# EAGLE design WT32-SC01 (EAGLE 9.6.2)
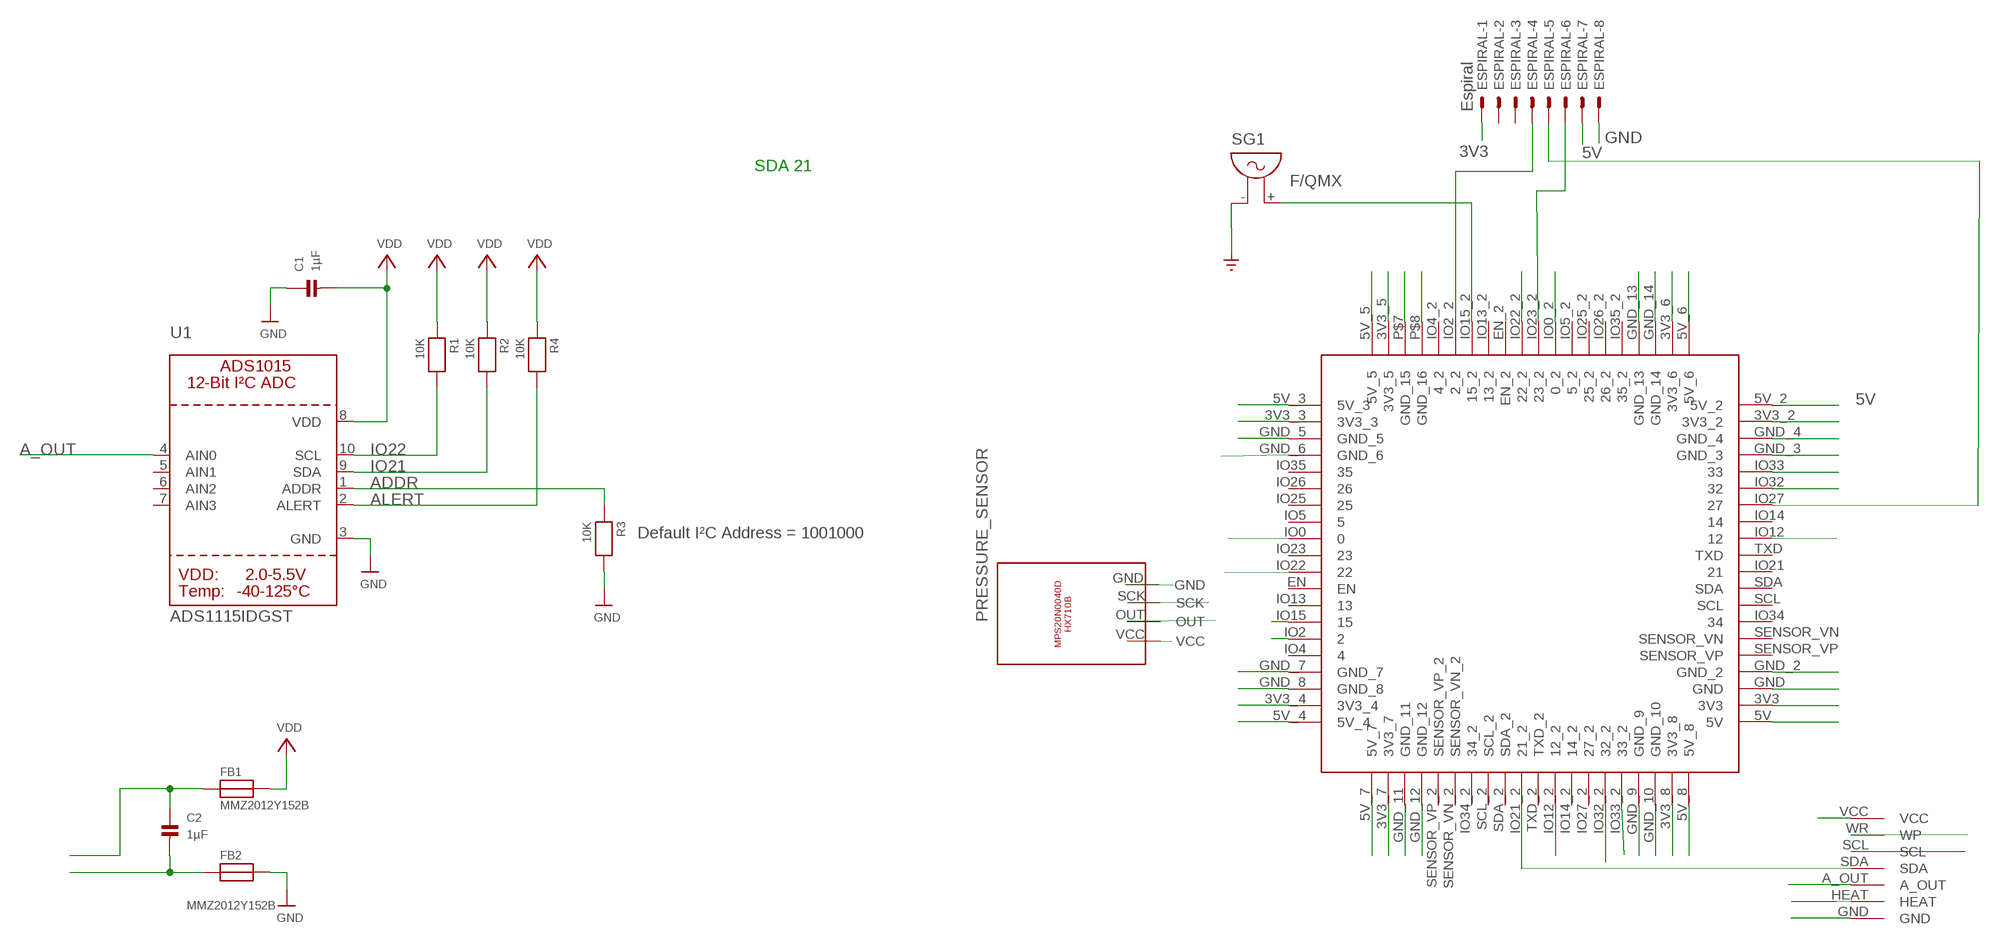
[diagram p0: schematic, sheet 1]

## Parts
C1  1µF  CAP_CERAMIC0805  [0805]
C2  1µF  CAP_CERAMIC0805  [0805]
ESPIRAL  Espiral  22-05-7088-08  [7395-08]
FB1  MMZ2012Y152B  FERRITE0805  [0805]
FB2  MMZ2012Y152B  FERRITE0805  [0805]
PRESSURE_SENSOR  PRESSURE_SENSORWITH_SMDPADS&THROUGHHOLES  [MPS20N0040D]
R1  10K  RESISTOR0805  [0805]
R2  10K  RESISTOR0805  [0805]
R3  10K  RESISTOR0805  [0805]
R4  10K  RESISTOR0805  [0805]
SG1  F/QMX  [F/QMX]
U1  ADS1115IDGST  ADC_ADS1015  [MSOP10]
U$1  SENSOR  [SENSOR]
U$2  WT32_SC01  [WT32]

## Nets
3V3: ESPIRAL.1 U$2.3V3 U$2.3V3_2 U$2.3V3_3 U$2.3V3_4 U$2.3V3_5 U$2.3V3_6
5V: ESPIRAL.7 FB1.2 PRESSURE_SENSOR.VCC U$1.VCC U$2.5V U$2.5V_2 U$2.5V_3 U$2.5V_4 U$2.5V_5 U$2.5V_6 U$2.5V_7 U$2.5V_8 ; supply symbol labelled VDD
A_OUT: U1.4(AIN0) U$1.A_OUT
ADDR: R3.1 U1.1(ADDR)
ALERT: R4.2 U1.2(ALERT)
GND: C1.1 ESPIRAL.8 FB2.2 PRESSURE_SENSOR.GND R3.2 SG1.- U1.3(GND) U$1.GND U$2.GND U$2.GND_2 U$2.GND_3 U$2.GND_4 U$2.GND_5 U$2.GND_6 U$2.GND_7 U$2.GND_8 U$2.GND_9 U$2.GND_10 U$2.GND_11 U$2.GND_12 U$2.GND_13 U$2.GND_14 U$2.P$7(GND_15) U$2.P$8(GND_16) ; supply symbol labelled SUPPLY_BRASTAN_GND_
IO0: U$1.HEAT U$2.IO0 U$2.IO0_2(0_2)
IO2: ESPIRAL.4 U$2.IO2 U$2.IO2_2(2_2)
IO12: U$1.WR(WP) U$2.IO12 U$2.IO12_2(12_2)
IO15: SG1.+ U$2.IO15 U$2.IO15_2(15_2)
IO21: R2.2 U1.9(SDA) U$1.SDA U$2.IO21_2(21_2)
IO22: R1.2 U1.10(SCL) U$1.SCL U$2.IO22 U$2.IO22_2(22_2)
IO32: PRESSURE_SENSOR.OUT U$2.IO32 U$2.IO32_2(32_2)
IO33: PRESSURE_SENSOR.SCK U$2.IO33 U$2.IO33_2(33_2)
N$1: ESPIRAL.6 U$2.IO23_2(23_2)
N$2: C2.2 FB2.1
N$3: C2.1 FB1.1
N$5: U$2.3V3_8
N$6: U$2.3V3_7
N$23: ESPIRAL.5 U$2.IO27
VDD: C1.2 R1.1 R2.1 R4.1 U1.8(VDD)
Unconnected: ESPIRAL.2 ESPIRAL.3 U1.5(AIN1) U1.6(AIN2) U1.7(AIN3) U$2.EN U$2.EN_2 U$2.IO4 U$2.IO4_2(4_2) U$2.IO5 U$2.IO5_2(5_2) U$2.IO13 U$2.IO13_2(13_2) U$2.IO14 U$2.IO14_2(14_2) U$2.IO21 U$2.IO23 U$2.IO25 U$2.IO25_2(25_2) U$2.IO26 U$2.IO26_2(26_2) U$2.IO27_2(27_2) U$2.IO34 U$2.IO34_2(34_2) U$2.IO35 U$2.IO35_2(35_2) U$2.SCL U$2.SCL_2 U$2.SDA U$2.SDA_2 U$2.SENSOR_VN U$2.SENSOR_VN_2 U$2.SENSOR_VP U$2.SENSOR_VP_2 U$2.TXD U$2.TXD_2

## Notes on the sheet
- SDA 21
- Default I²C Address = 1001000

## Library data of the parts
C1 C2 = microbuilder:CAP_CERAMIC: Ceramic Capacitors 0402 - 0402 Surface Mount Capacitors 16pF 50V 5% [Digikey: 445-4899-2-ND] 18pF 50V 5% [Digikey: 490-1281-2-ND] 22pF 50V 5% [Digikey: 490-1283-2-ND] 68pF 50V 5% [Digikey: 490-1289-2-ND] 0.1uF 10V 10% [Digikey: 490-1318-2-ND] 1.0uF 6.3V 10% [Digikey: 490-1320-2-ND] 0603 - 0603 Surface Mount Capacitors 16 pF 50V 5% [Digikey: 445-5051-2-ND] 22 pF 50V [Digikey: PCC220ACVTR-ND] 33 pF 50V 5% [Digikey: 490-1415-1-ND] 56pF 50V 5% [Digikey: 490-1421-1-ND] 220pF 50V 5% [Digikey: 445-1285-1-ND] 680 pF 50V 2200 pF 50V 5% C0G [Digikey: 445-1297-1-ND] 5600 pF 100V 5% X7R [Digikey: 478-3711-1-ND] 0.1 µF 25V 10% [Digikey: PCC2277TR-ND] 0.22 µF 16V 10% X7R [Digikey: 445-1318-1-ND] 1.0 µF 25V 10% [Digikey: 445-5146-2-ND] 0603 - RF Specific 3pF 250V +/-0.1pF RF [Digikey: 712-1347-1-ND] 18 pF 250V 5% [Digikey: 478-3505-1-ND or 712-1322-1-ND] 56 pF 250V 5% C0G RF [Digikey: 490-4867-1-ND] 68 pF 250V RF [Digikey: 490-4868-1-ND] 0805 - 0805 Surface Mount Capacitors 220 pF 250V 2% RF Ceramic Capacitor [Digikey: 712-1398-1-ND] 1000 pF 50V 2% NP0 Ceramic Capacitor [Digikey: 478-3760-1-ND] 0.1 µF 25V 10% Ceramic Capacitor [Digikey: PCC1828TR-ND] 1.0 µF 16V 10% Ceramic Capacitor[Digikey: 490-1691-2-ND] 10.0 µF 10V 10% Ceramic Capacitor[Digikey: 709-1228-1-ND] 10.0 uF 16V 10% Ceramic Capacitor [Digikey: 478-5165-2-ND] 47 uF 6.3V 20% Ceramic Capacitor [Digikey: 587-1779-1-ND or 399-5506-1-ND] 1206 - 1206 Surface Mount Capacitors 47uF 10V 20% Ceramic Capacitor [Digikey: 490-5528-1-ND or 399-5508-1-ND or 445-6010-1-ND] 100uF 6.3V -20%, +80% Y5V Ceramic Capacitor (Digikey: 490-4512-1-ND, Mouser: 81-GRM31CF50J107ZE1L)
ESPIRAL = con-molex:22-?-08: CONNECTOR wire to board 2.54 mm (.1 inch) pitch header; MF: MOLEX; OC_FARNELL: unknown; OC_NEWARK: unknown
FB1 FB2 = microbuilder:FERRITE: Ferrite Bead 0603 MMZ1608B121C - 120 Ohm, 600mA Ferrite Chip - Digikey: 445-2164-1-ND BK1608HW121-T - 120 Ohm, 600mA Ferrite Chip - Digikey: 587-1876-2-ND 0805 HZ0805B272R-10 - 2.7K Ohm @ 100MHz, 200mA 0.8 Ohm DC Resistance - Digikey: 240-2504-1-ND (see also Murata BLM21BD272SN1L)
PRESSURE_SENSOR = MPS20N0040D-S - PRESSURE SENSOR:PRESSURE_SENSOR
R1-R4 = microbuilder:RESISTOR: Resistors 0402 - 0402 Surface Mount Package 22 Ohm 1% 1/16W [Digikey: 311-22.0LRTR-ND] 33 Ohm 5% 1/16W 1.0K 5% 1/16W 1.5K 5% 1/16W 2.0K 1% 1/16W 10.0K 1% 1/16W [Digikey: 311-10.0KLRTR-ND] 10.0K 5% 1/16W [Digikey: RMCF0402JT10K0TR-ND] 12.1K 1% 1/16W [Digikey: 311-22.0LRTR-ND] 100.0K 5% 1/16W 0603 - 0603 Surface Mount Package 0 Ohm 1/10 Watt 1% Resistor 15 Ohm 1/10 Watt 1% Resistor 33 Ohm 1/10 Watt 1% Resistor 49.9 Ohm 1/10 Watt 1% Resistor 100 Ohm 1/10 Watt 1% Resistor 150 Ohm 1/10 Watt 1% Resistor 240 Ohm 1/10 Watt 1% Resistor 390 Ohm 1/10 Watt 1% Resistor 560 Ohm 1/10 Watt 1% Resistor 680 Ohm 1/10 Watt 1% Resistor 750 Ohm 1/10 Watt 1% Resistor 1.0K Ohm 1/10 Watt 1% Resistor 1.5K Ohm 1/10 Watt 1% Resistor 2.0K Ohm 1/10 Watt 1% Resistor 2.2K Ohm 1/10 Watt 1% Resistor 3.3K Ohm 1/10 Watt 1% Resistor 4.7K Ohm 1/10 Watt 1% Resistor 10.0K Ohm 1/10 Watt 1% Resistor 12.0K Ohm 1/10 Watt 1% Resistor 12.1K Ohm 1/10 Watt 1% Resistor 20.0K Ohm 1/10 Watt 1% Resistor 33.0K Ohm 1/10 Watt 1% Resistor 100.0K Ohm 1/10 Watt 1% Resistor 0805 - 0805 Surface Mount Package 0 Ohm 1/8 Watt 1% Resistor 33 Ohm 1/8 Watt 1% Resistor 100 Ohm 1/8 Watt 1% Resistor 150 Ohm 1/8 Watt 1% Resistor 200 Ohm 1/8 Watt 1% Resistor 240 Ohm 1/8 Watt 1% Resistor 330 Ohm 1/8 Watt 1% Resistor 390 Ohm 1/8 Watt 1% Resistor 470 Ohm 1/8 Watt 1% Resistor 1.0K Ohm 1/8 Watt 1% Resistor 1.5K Ohm 1/8 Watt 1% Resistor 2.0K Ohm 1/8 Watt 1% Resistor 4.7K Ohm 1/8 Watt 1% Resistor 5.1K Ohm 1/8 Watt 1% Resistor 5.6K Ohm 1/8 Watt 1% Resistor 10.0K Ohm 1/8 Watt 1% Resistor 22.0K Ohm 1/8 Watt 1% Resistor 33.0K Ohm 1/8 Watt 1% Resistor 100K Ohm 1/8 Watt 1% Resistor 1206 - 1206 Surface Mount Package 2012 - 2010 Surface Mount Package 0.11 Ohm 1/2 Watt 1% Resistor - Digikey: RHM.11UCT-ND
SG1 = buzzer:F/QMX: BUZZER Source: Buerklin; OC_FARNELL: unknown; OC_NEWARK: unknown
U1 = microbuilder:ADC_ADS1015: ADS1015 - 12-bit 4-Channel I2C ADC with Internal PGA VDD: 2.0-5.5V Sampling Rate: 3.3ksps Gain Settings: 2/3, 1, 2, 4, 8, 16 I2C Address: ADDR low = 1001000x, ADDR high = 1001001x Internal Comparator The ADS1015 includes an internal comparator that can be set to output a high-level on ALERT when the conversion results exceeeds a pre-defined upper level, and will deassert itself when the level falls below a pre-defined lower threshold level. It can also be set to windowed mode where the ALERT pin will be asserted if the data exceeds the upper threshold or falls below the lower threshold.
U$1 = Sensor+eeprom:SENSOR
U$2 = WT32_SC01:WT32_SC01

## Net classes
1 New Class: width 0.5 mm, clearance 0.205 mm to class 0, clearance 0.205 mm

## Board
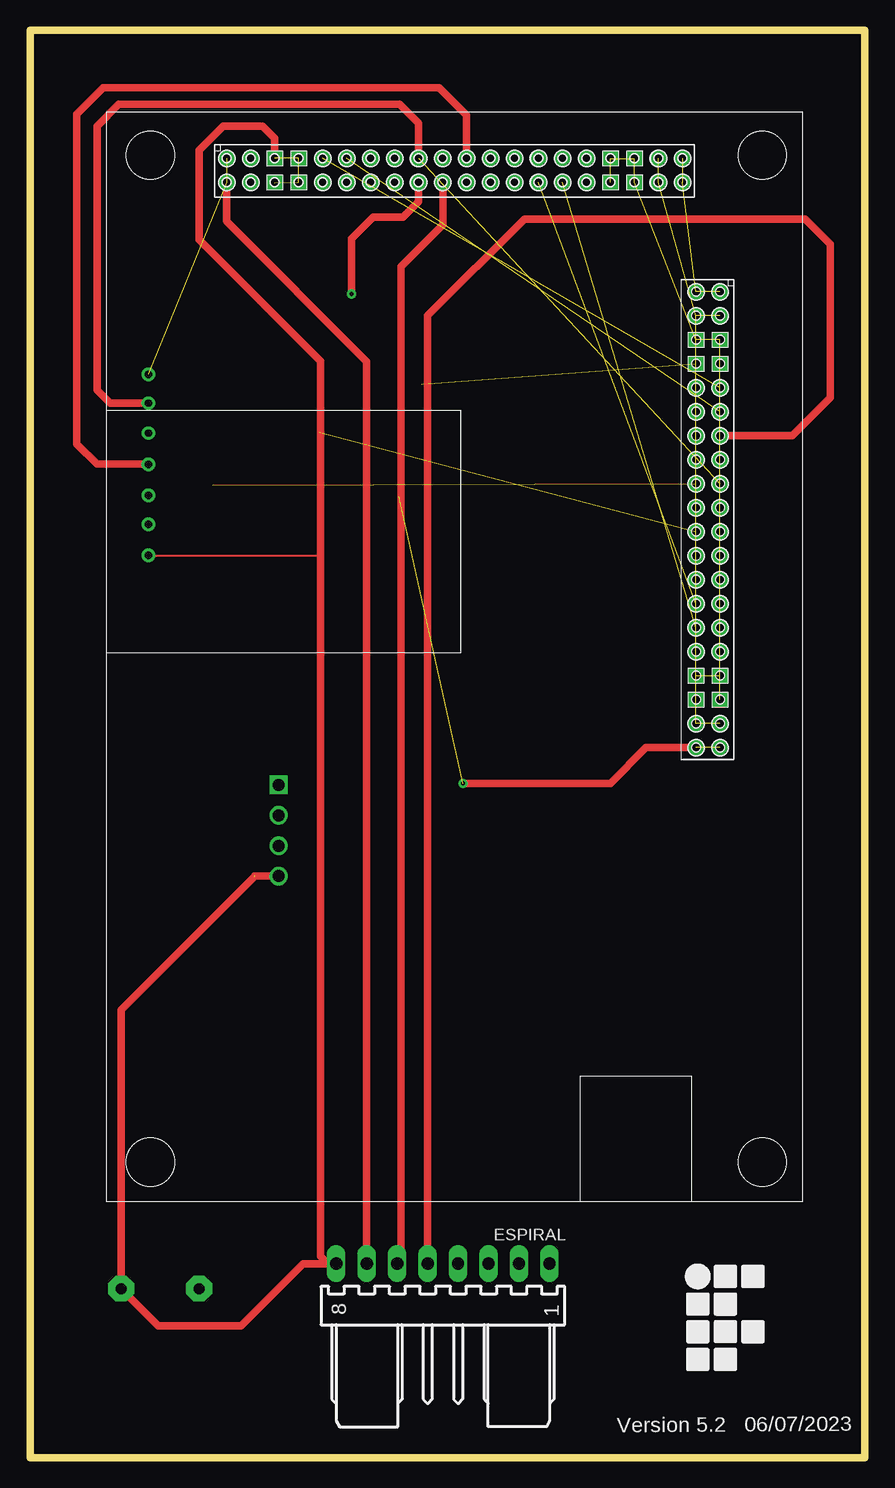
[diagram p1: board, top side]
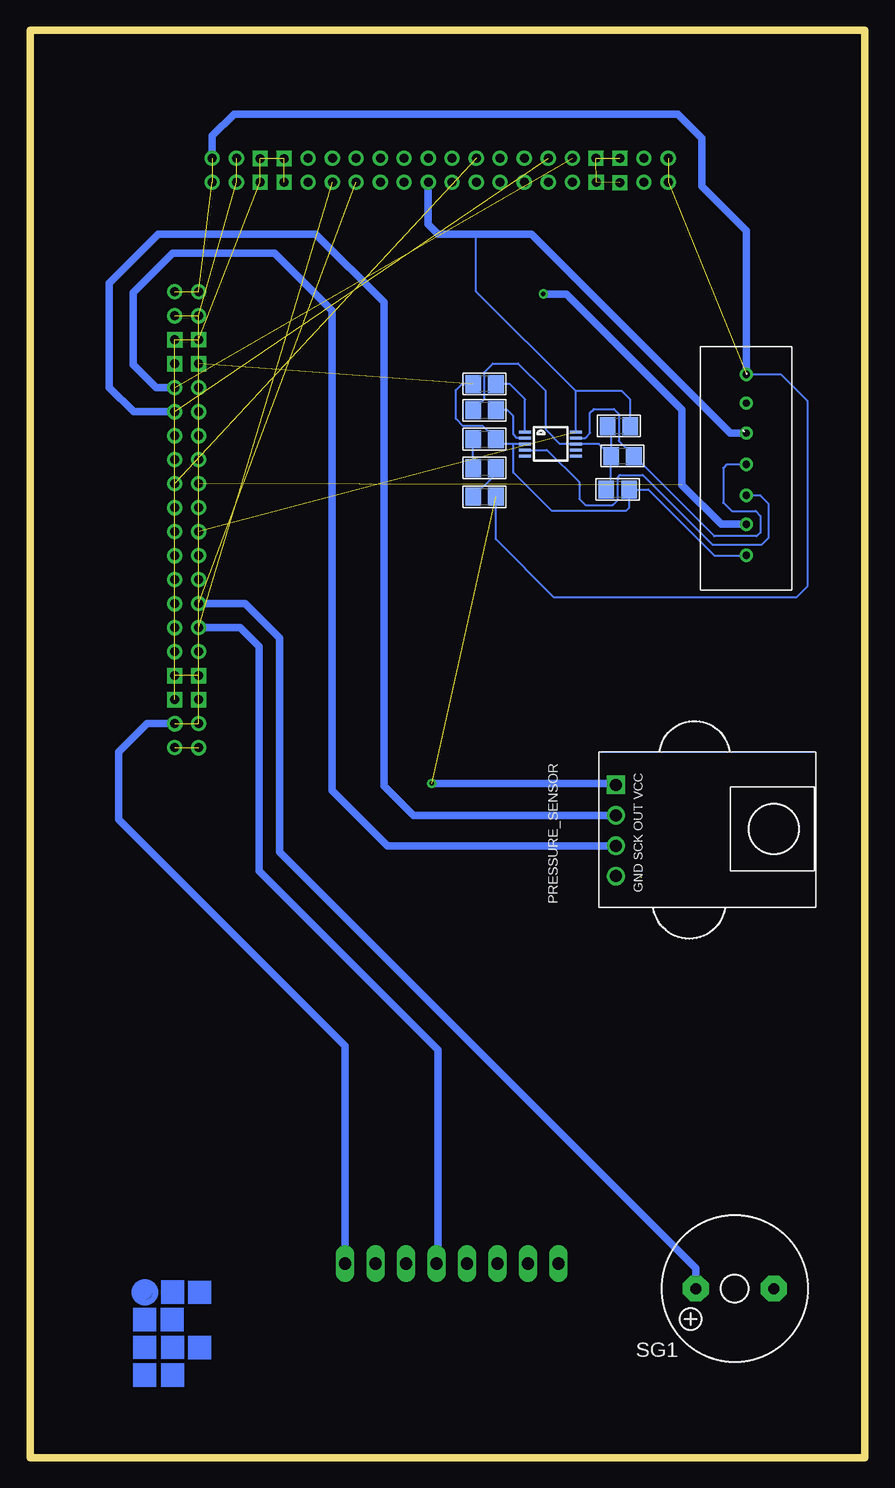
[diagram p2: board, bottom side, seen from below]

Size 69.6 x 119 mm. Coordinates in mm from the lower left corner, seen from the top.
Outline: 0,119 0,0 69.6,0 69.6,119 0,119
Copper layers (1*16): Top 0.035mm / dielectric 1.5mm / Bottom 0.035mm
Design rules "default": minimum track width 6mil, minimum drill 0.35mm, track to track 6mil, track to pad 6mil, pad to pad 6mil, via to via 6mil, smd to smd 6mil, copper to edge 40mil, drill to drill 6mil, minimum pad ring 10mil, minimum via ring 8mil, stop-mask expansion 4mil, vias tented up to drill 0mil, thermal gap 10mil

### Footprints (pad centres in the part's own frame; a part is rotated, then mirrored left to right if it is on the bottom)
0805 = smd 1.3 x 1.5: 1 -0.95,0; 2 0.95,0
7395-08 = drill 1.016 long: 1 8.89,0; 2 6.35,0; 3 3.81,0; 4 1.27,0; 5 -1.27,0; 6 -3.81,0; 7 -6.35,0; 8 -8.89,0
MPS20N0040D = drill 1: GND 3.81,-1.338; OUT -1.27,-1.338; SCK 1.27,-1.338 | drill 1 square: VCC -3.81,-1.338
F/QMX = drill 0.914 pad 2.159 octagon: + 3.251,0; - -3.251,0
MSOP10 = smd 0.25 x 1: 1 -1,-2.113; 2 -0.5,-2.113; 3 0,-2.113; 4 0.5,-2.113; 5 1,-2.113; 6 1,2.113; 7 0.5,2.113; 8 0,2.113; 9 -0.5,2.113; 10 -1,2.113
SENSOR = drill 0.6: A_OUT 14,7.9; GND 14,2.9; HEAT 14,5.5; SCL 14,13.1; SDA 14,10.5; VCC 14,18; WR 14,15.6
WT32 = drill 0.75: 3V3 -22.56,-18.56; 3V3_2 -22.57,-20.55; 3V3_3 11.43,-18.56; 3V3_4 11.43,-20.57; 3V3_5 22.56,-15.42; 3V3_6 24.57,-15.42; 3V3_7 22.56,18.57; 3V3_8 24.57,18.57; 5V -24.57,-18.57; 5V_2 -24.56,-20.56; 5V_3 13.44,-18.56; 5V_4 13.44,-20.57; 5V_5 22.56,-17.43; 5V_6 24.57,-17.43; 5V_7 22.56,20.58; 5V_8 24.57,20.58; EN -8.56,-18.56; EN_2 22.57,-1.43; IO0 -2.56,-18.56; IO0_2 22.56,4.58; IO2 -14.56,-18.57; IO2_2 22.56,-7.42; IO4 -16.56,-18.57; IO4_2 22.56,-9.43; IO5 -0.56,-18.56; IO5_2 22.56,6.57; IO12 -2.56,-20.56; IO12_2 24.57,4.58; IO13 -10.56,-18.57; IO13_2 22.57,-3.42; IO14 -0.56,-20.57; IO14_2 24.57,6.57; IO15 -12.56,-18.57; IO15_2 22.57,-5.43; IO21 -6.56,-20.56; IO21_2 24.58,0.58; IO22 -6.57,-18.57; IO22_2 22.57,0.58; IO23 -4.56,-18.57; IO23_2 22.56,2.57; IO25 1.43,-18.56; IO25_2 22.56,8.58; IO26 3.43,-18.56; IO26_2 22.56,10.58; IO27 1.43,-20.57; IO27_2 24.57,8.58; IO32 3.43,-20.57; IO32_2 24.57,10.58; IO33 5.44,-20.57; IO33_2 24.57,12.59; IO34 -12.57,-20.57; IO34_2 24.58,-5.43; IO35 5.44,-18.56; IO35_2 22.56,12.59; SCL -10.55,-20.57; SCL_2 24.58,-3.42; SDA -8.57,-20.57; SDA_2 24.58,-1.43; SENSOR_VN -14.57,-20.57; SENSOR_VN_2 24.57,-7.42; SENSOR_VP -16.57,-20.57; SENSOR_VP_2 24.57,-9.43; TXD -4.57,-20.57; TXD_2 24.57,2.57 | drill 0.75 square: GND -20.57,-18.56; GND_2 -18.57,-18.56; GND_3 -20.57,-20.56; GND_4 -18.57,-20.56; GND_5 7.43,-18.56; GND_6 9.44,-18.57; GND_7 22.56,-13.43; GND_8 22.56,-11.43; GND_9 24.55,-13.43; GND_10 24.55,-11.43; GND_11 22.57,14.58; GND_12 22.54,16.57; GND_13 24.56,14.57; GND_14 24.56,16.56; P$7 7.43,-20.56; P$8 9.43,-20.55

### Placement (x,y rotation side)
C1  20.6,80.7 180 bottom
C2  31.7,82.5 180 bottom
ESPIRAL  34.43,16.16 0 top
FB1  31.7,80.1 0 bottom
FB2  31.7,84.9 0 bottom
PRESSURE_SENSOR  19.4,52.27 270 bottom
R1  20.5,86 0 bottom
R2  20.2,83.5 0 bottom
R3  31.7,89.5 180 bottom
R4  31.7,87.3 0 bottom
SG1  10.84,14.08 180 bottom
U1  26.2,84.5 270 bottom
U$1  23.87,72.3 0 bottom
U$2  36.97,83.74 90 top

### Tracks (layer width: path | path; a pad name or v marks a point on that pad's centre or on a via)
3V3  (5 unrouted)
  Bottom 0.61: ESPIRAL.1 43.32,34.32 48.5,39.5 48.7,39.7 62.2,53.2 62.2,58.8 59.83,61.17 U$2.3V3_2
5V  (via drill 0.35)  (7 unrouted)
  Top 0.61: ESPIRAL.7 28.08,91.36 16.39,103.05 U$2.5V_7 | v36.1,56.2 48.4,56.2 51.37,59.17 U$2.5V
  Bottom 0.152: U$1.VCC 7,90.3 4.8,88.1 4.8,72.6 5.7,71.7 25.9,71.7 30.75,76.55 FB1.2
  Bottom 0.61: U$1.VCC 9.87,102.27 13.6,106 13.6,110 15.6,112 52.6,112 54.4,110.2 U$2.5V_6 | PRESSURE_SENSOR.VCC 20.84,56.18 36.08,56.18 v36.1,56.2
A_OUT
  Bottom 0.152: U1.4 26.5,84 23.8,81.3 23.8,79.9 23.3,79.4 21,79.4 20.6,79.8 20.6,81.7 20.4,81.9 18.5,81.9 12.7,76.1 8.6,76.1 8,76.7 8,79.5 8.7,80.2 U$1.A_OUT
ADDR
  Bottom 0.152: U1.1 28.31,88.21 29.6,89.5 R3.1
ALERT
  Bottom 0.152: U1.2 29,85 29.3,85.3 29.3,86.8 29.8,87.3 R4.2
GND  (16 unrouted)
  Top 0.152: U$1.GND 24.24,75.2
  Top 0.61: 24.24,66.7 24.24,75.2 24.24,91.39 14.11,101.52 14.11,109 16.11,111 19.4,111 20.41,109.99 U$2.GND_14 | 24.24,66.7 24.24,16.76 24.84,16.16 ESPIRAL.8 22.76,16.16 17.6,11 10.67,11 SG1.- 7.59,37.31 18.64,48.36 | 18.74,48.46 PRESSURE_SENSOR.GND | 24.23,66.71 24.24,66.7
  Bottom 0.152: U1.3 29.3,84.5 | 29.3,84.5 30.35,84.5 FB2.2 31.85,86 33.5,86 34.1,86.6 34.1,89 33.6,89.5 R3.2 | U$1.GND 12.55,75.2 18.05,80.7 C1.1 19.65,79.15 19.9,78.9 26.1,78.9 29.3,82.1 29.3,84.5
IO0  (via drill 0.35)  (1 unrouted)
  Top 0.61: v26.8,97 26.8,101.6 28.6,103.4 31.1,103.4 32.39,104.69 U$2.IO0_2
  Bottom 0.61: U$1.HEAT 11.97,77.8 15.24,81.06 15.24,87.36 24.87,97 v26.8,97
IO2  (1 unrouted)
  Bottom 0.61: ESPIRAL.4 35.6,16.26 35.6,34 50.5,48.9 50.5,67.6 52.08,69.18 U$2.IO2
IO12  (1 unrouted)
  Top 0.61: U$1.WR 6.7,87.9 5.6,89 5.6,111 7.4,112.8 30.8,112.8 32.39,111.21 U$2.IO12_2
IO15  (1 unrouted)
  Bottom 0.61: SG1.+ 14.09,15.79 48.8,50.5 48.8,68.3 51.68,71.18 U$2.IO15
IO21
  Top 0.61: U$1.SDA 5.6,82.8 3.9,84.5 3.9,112 6.1,114.2 34.1,114.2 36.39,111.91 U$2.IO21_2
  Bottom 0.152: U$1.SDA 11.5,82.8 11.8,82.5 11.8,79.6 11.1,78.9 9.1,78.9 8.7,78.5 8.7,77.1 9,76.8 12.55,76.8 19.18,83.42 R2.2 19.35,83.6 20.5,84.75 20.5,87 20.9,87.4 22.6,87.4 22.9,87.1 22.9,85.4 23.3,85 U1.9
IO22  (1 unrouted)
  Bottom 0.152: U1.10 24.09,88.89 | 32.4,102 32.4,97.2 24.09,88.89 | R1.2 19.55,88.2 20.24,88.89 24.09,88.89
  Bottom 0.61: U$1.SCL 11.2,85.4 27.8,102 32.4,102 35.6,102 36.4,102.8 U$2.IO22_2
IO32  (1 unrouted)
  Bottom 0.61: PRESSURE_SENSOR.OUT 37.64,53.54 40.1,56 40.1,96.3 45.8,102 58.9,102 63,97.9 63,89.2 60.97,87.17 U$2.IO32
IO33  (1 unrouted)
  Bottom 0.61: PRESSURE_SENSOR.SCK 39.8,51 44.4,55.6 44.4,95.6 49.2,100.4 57.7,100.4 61,97.1 61,91.1 59.08,89.18 U$2.IO33
N$1
  Top 0.61: ESPIRAL.6 30.92,16.46 30.92,99.28 34.43,102.79 34.43,106.27 U$2.IO23_2
N$2
  Bottom 0.152: C2.2 FB2.1
N$3
  Bottom 0.152: FB1.1 30.75,82 C2.1
N$23
  Top 0.61: ESPIRAL.5 33.16,95.17 41.21,103.22 64.66,103.22 66.74,101.14 66.74,88.35 63.56,85.17 U$2.IO27
VDD
  Bottom 0.152: R2.1 22.15,84.5 U1.8 25.4,84.5 26.6,85.7 26.6,88.9 28.9,91.2 31,91.2 31.7,90.5 31.7,88.25 R4.1 | R1.1 21.15,85.7 R2.1 | C1.2 21.15,81.1 R2.1
(copper drawn outside any net)
  shapes: Bottom area x9, Bottom circle x3

### Text on the board
tNames: Version 5.2 06/07/2023